# EAGLE design vusbtiny_version (EAGLE 6.5.0)
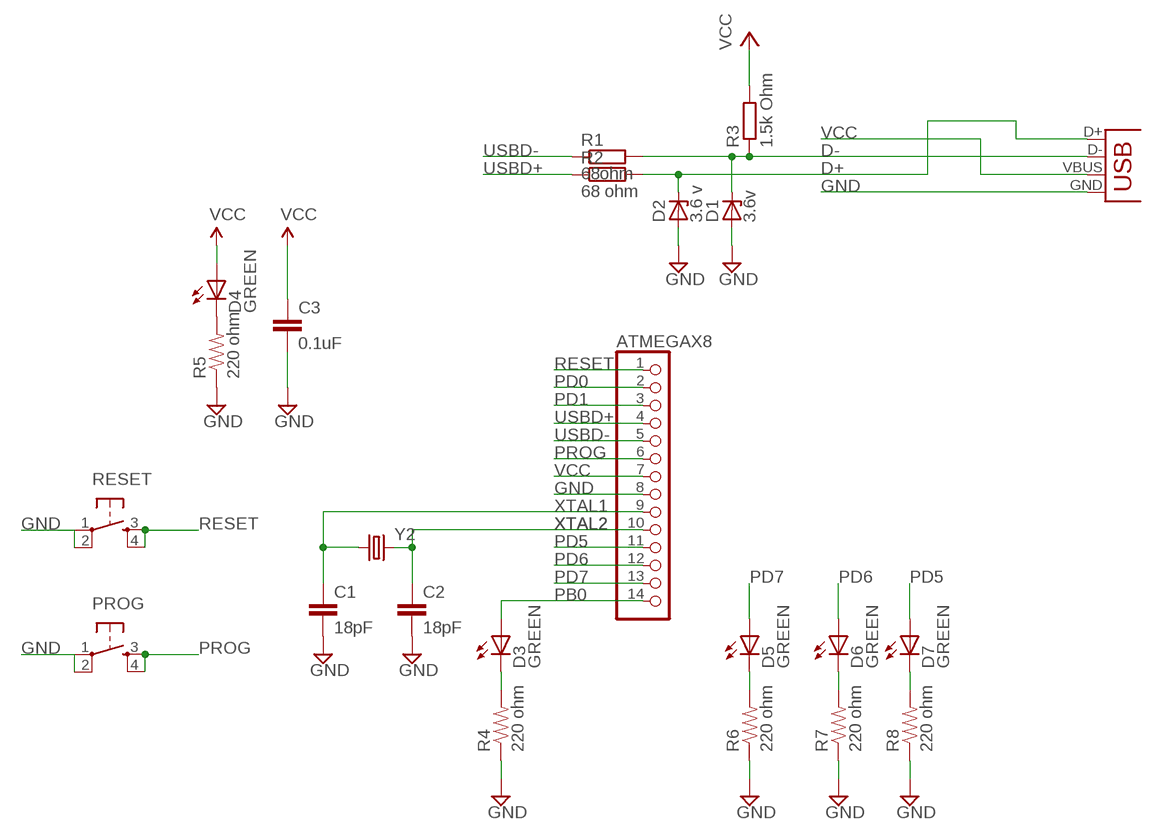
[diagram p0: schematic, sheet 1]

## Parts
ATMEGAX8  PINHD-1X14  [1X14]
C1  18pF  CAP1206  [1206]
C2  18pF  CAP1206  [1206]
C3  0.1uF  CAP1206  [1206]
D1  3.6v  ZENER-DIODESOT23  [SOT23]
D2  3.6 v  ZENER-DIODESOT23  [SOT23]
D3  GREEN  LED-GREENLARGE  [LED-1206]
D4  GREEN  LED-GREENLARGE  [LED-1206]
D5  GREEN  LED-GREENLARGE  [LED-1206]
D6  GREEN  LED-GREENLARGE  [LED-1206]
D7  GREEN  LED-GREENLARGE  [LED-1206]
JP1  USBSMD  [USB-MINIB]
PROG  TAC_SWITCHPTH  [TACTILE-PTH]
R1  68ohm  R-EU_R0805  [R0805]
R2  68 ohm  R-EU_R0805  [R0805]
R3  1.5k Ohm  R-EU_R1206  [R1206]
R4  220 ohm  RESISTOR1206  [1206]
R5  220 ohm  RESISTOR1206  [1206]
R6  220 ohm  RESISTOR1206  [1206]
R7  220 ohm  RESISTOR1206  [1206]
R8  220 ohm  RESISTOR1206  [1206]
RESET  TAC_SWITCHPTH  [TACTILE-PTH]
Y2  CRYSTALHC49US  [HC49US]

## Nets
D+: D2.3(C) JP1.D+ R2.2
D-: D1.3(C) JP1.D- R1.2 R3.1
GND: ATMEGAX8.8 C1.2 C2.2 C3.2 D1.1(A) D2.1(A) JP1.GND PROG.1 PROG.2 R4.1 R5.1 R6.1 R7.1 R8.1 RESET.1 RESET.2
N$1: D3.C R4.2
N$3: D4.C R5.2
N$4: D5.C R6.2
N$5: D6.C R7.2
N$6: D7.C R8.2
PB0: ATMEGAX8.14 D3.A
PD0: ATMEGAX8.2
PD1: ATMEGAX8.3
PD5: ATMEGAX8.11 D7.A
PD6: ATMEGAX8.12 D6.A
PD7: ATMEGAX8.13 D5.A
PROG: ATMEGAX8.6 PROG.3 PROG.4
RESET: ATMEGAX8.1 RESET.3 RESET.4
USBD+: ATMEGAX8.4 R2.1
USBD-: ATMEGAX8.5 R1.1
VCC: ATMEGAX8.7 C3.1 D4.A JP1.VBUS R3.2
XTAL1: ATMEGAX8.9 C1.1 Y2.1
XTAL2: ATMEGAX8.10 C2.1 Y2.2

## Library data of the parts
ATMEGAX8 = pinhead:PINHD-1X14: PIN HEADER
C1-C3 = SparkFun-Capacitors:CAP: Capacitor Standard 0603 ceramic capacitor, and 0.1" leaded capacitor.
D1 D2 = diode:ZENER-DIODE: Z-Diode
D3-D7 = SparkFun-LED:LED-GREEN: Various green LEDs 0603- DIO-00821 LARGE- DIO-00862 LILYPAD- DIO-09910; PROD_ID: DIO-00862
JP1 = SparkFun-Connectors:USB: USB Connectors USB-B-PTH is fully proven SKU : PRT-00139/CONN-08278 USB-miniB is fully proven SKU : PRT-00587 USB-A-PCB is untested. USB-A-H is throughly reviewed, but untested. Spark Fun Electronics SKU : PRT-00437 USB-B-SMT is throughly reviewed, but untested. Needs silkscreen touching up. USB-A-S has not been used/tested USB-MB-H has not been used/tested USB-MICROB has been used. CONN-09505; PROD_ID: CONN-08193
PROG RESET = SparkFun-Electromechanical:TAC_SWITCH: Momentary Switch Button commonly used for reset or general input. Spark Fun Electronics SKU : COM-00097 SMT- SWCH-08247
R1-R3 = resistor:R-EU_: RESISTOR, European symbol
R4-R8 = SparkFun-Passives:RESISTOR: Resistor Basic schematic elements and footprints for 0603, 1206, and PTH resistors.
Y2 = SparkFun-FreqCtrl:CRYSTAL: Various standard crystals. Proven footprints. Spark Fun Electronics SKU : COM-00534

## Board
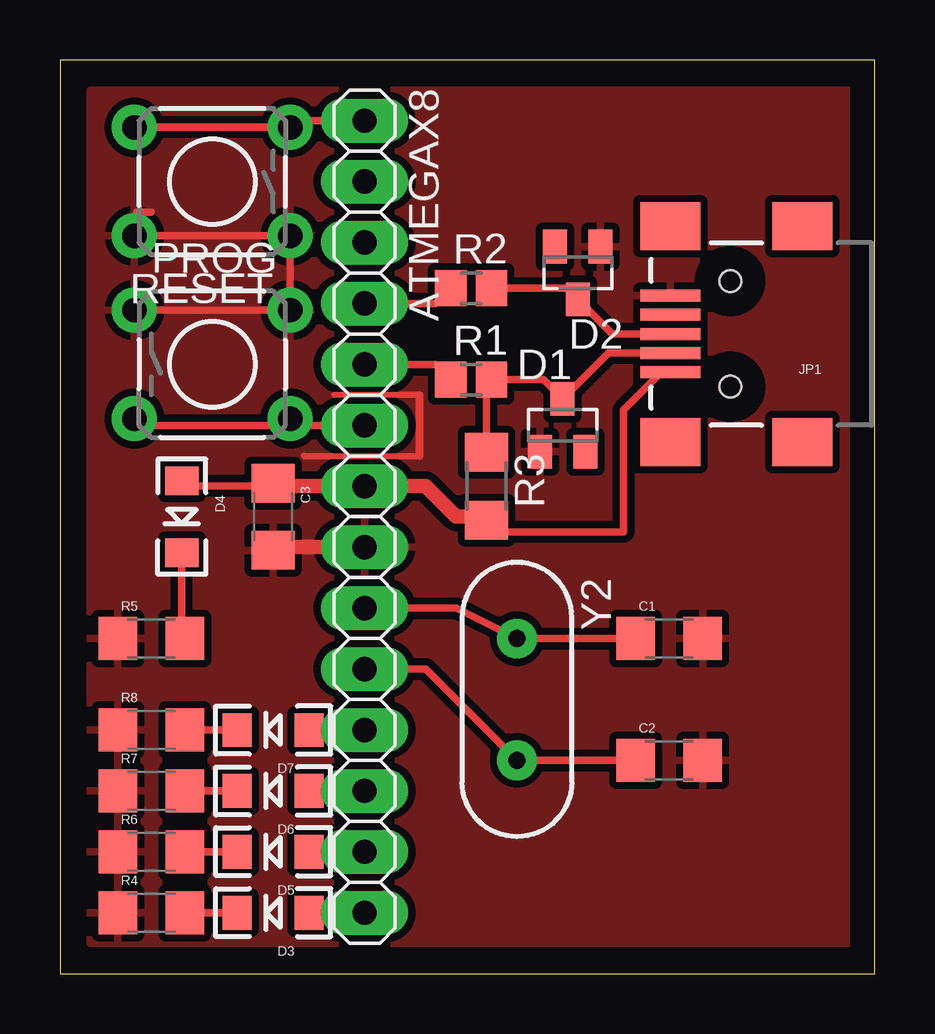
[diagram p1: board, top side]

Size 33.96 x 38.09 mm. Coordinates in mm from the lower left corner, seen from the top.
Outline: 0,0 33.96,0 33.96,38.09 0,38.09 0,0
Copper layers (1*16): Top 0.035mm / dielectric 1.5mm / Bottom 0.035mm
Design rules "improved_12mil": minimum track width 12mil, minimum drill 0.8mm, track to track 12mil, track to pad 12mil, pad to pad 12mil, via to via 12mil, smd to smd 12mil, copper to edge 40mil, drill to drill 12mil, minimum pad ring 16mil, minimum via ring 16mil, stop-mask expansion 4mil, vias tented up to drill 0mil, thermal gap 12mil

### Footprints (pad centres in the part's own frame; a part is rotated, then mirrored left to right if it is on the bottom)
1X14 = drill 1.016 long: 1 -16.51,0; 2 -13.97,0; 3 -11.43,0; 4 -8.89,0; 5 -6.35,0; 6 -3.81,0; 7 -1.27,0; 8 1.27,0; 9 3.81,0; 10 6.35,0; 11 8.89,0; 12 11.43,0; 13 13.97,0; 14 16.51,0
1206 = smd 1.6 x 1.8: 1 -1.4,0; 2 1.4,0
SOT23 = smd 1 x 1.4: 1 -0.95,-1.1; 2 0.95,-1.1; 3 0,1.1
LED-1206 = smd 1.2 x 1.4: A -1.5,0; C 1.5,0
USB-MINIB = smd 2.5 x 0.5: D+ 2.5,0; D- 2.5,0.8; GND 2.5,-1.6; ID 2.5,-0.8; VBUS 2.5,1.6 | smd 2.5 x 2: MTN1 -3,4.5; MTN2 2.5,4.5; MTN3 -3,-4.5; MTN4 2.5,-4.5 | hole 0.9: 0,2.2; 0,-2.2
TACTILE-PTH = drill 1.016 pad 1.88: 1 -3.251,2.261; 2 3.251,2.261; 3 -3.251,-2.261; 4 3.251,-2.261
R0805 = smd 1.3 x 1.5: 1 -0.85,0; 2 0.85,0
R1206 = smd 1.6 x 1.803: 1 -1.422,0; 2 1.422,0
HC49US = drill 0.7 pad 1.651: 1 -2.54,0; 2 2.54,0

### Placement (x,y rotation side)
ATMEGAX8  12.7,19.05 270 top
C1  25.4,13.97 0 top
C2  25.4,8.89 0 top
C3  8.89,19.05 270 top
D1  20.95,22.86 0 top
D2  21.59,29.21 180 top
D3  8.89,2.54 180 top
D4  5.08,19.05 270 top
D5  8.89,5.08 180 top
D6  8.89,7.62 180 top
D7  8.89,10.16 180 top
JP1  27.94,26.67 180 top
PROG  6.35,25.4 0 top
R1  17.14,24.77 0 top
R2  17.14,28.57 0 top
R3  17.78,20.32 270 top
R4  3.81,2.54 0 top
R5  3.81,13.97 0 top
R6  3.81,5.08 0 top
R7  3.81,7.62 0 top
R8  3.81,10.16 0 top
RESET  6.35,33.02 180 top
Y2  19.05,11.43 270 top

### Tracks (layer width: path | path; a pad name or v marks a point on that pad's centre or on a via)
D+
  Top 0.305: R2.2 21.12,28.57 D2.3 23.03,26.67 JP1.D+
D-
  Top 0.305: JP1.D- 22.86,25.87 D1.3 20.15,24.77 R1.2 17.78,24.55 R3.1
GND
  Top 0.254: 10.16,21.59 14.99,21.59 | 14.99,24.13 11.43,24.13
  Top 0.305: RESET.2 RESET.1 PROG.2 PROG.1 | 3.81,31.75 3.2,31.75 | 14.99,24.13 14.99,21.59
  Top 0.61: ATMEGAX8.8 9.02,17.78 C3.2
  pour Top: 1.27,36.83 1.27,1.27 33.02,1.27 33.02,36.83
N$1
  Top 0.305: 7.62,2.54 D3.C R4.2 5.08,2.54
N$3
  Top 0.305: 5.08,17.78 D4.C 5.08,13.97 R5.2
N$4
  Top 0.305: 7.62,5.08 D5.C R6.2 5.08,5.08
N$5
  Top 0.305: 7.62,7.62 D6.C R7.2 5.08,7.62
N$6
  Top 0.305: 7.62,10.16 D7.C R8.2 5.08,10.16
PB0
  Top 0.305: ATMEGAX8.14 D3.A 10.16,2.54
PD5
  Top 0.305: ATMEGAX8.11 D7.A 10.16,10.16
PD6
  Top 0.305: ATMEGAX8.12 D6.A 10.16,7.62
PD7
  Top 0.305: ATMEGAX8.13 D5.A 10.16,5.08
PROG
  Top 0.305: ATMEGAX8.6 10.16,22.86 PROG.4 8.89,22.86 3.81,22.86 PROG.3
RESET
  Top 0.305: RESET.4 RESET.3 10.16,35.56 ATMEGAX8.1
USBD+
  Top 0.305: ATMEGAX8.4 15.66,27.94 R2.1
USBD-
  Top 0.305: ATMEGAX8.5 15.66,25.4 R1.1
VCC
  Top 0.305: JP1.VBUS 25.07,25.07 23.5,23.49 23.5,18.41 18.26,18.41 R3.2 | D4.A 5.08,20.32 8.89,20.32 C3.1
  Top 0.61: C3.1 9.02,20.32 ATMEGAX8.7 15.24,20.32 16.51,19.05 17.63,19.05 R3.2
XTAL1
  Top 0.305: ATMEGAX8.9 16.51,15.24 Y2.1 C1.1
XTAL2
  Top 0.305: ATMEGAX8.10 15.24,12.7 Y2.2 C2.1